# Altium schematic sheet DIB_Driver_Interface.SchDoc
size A
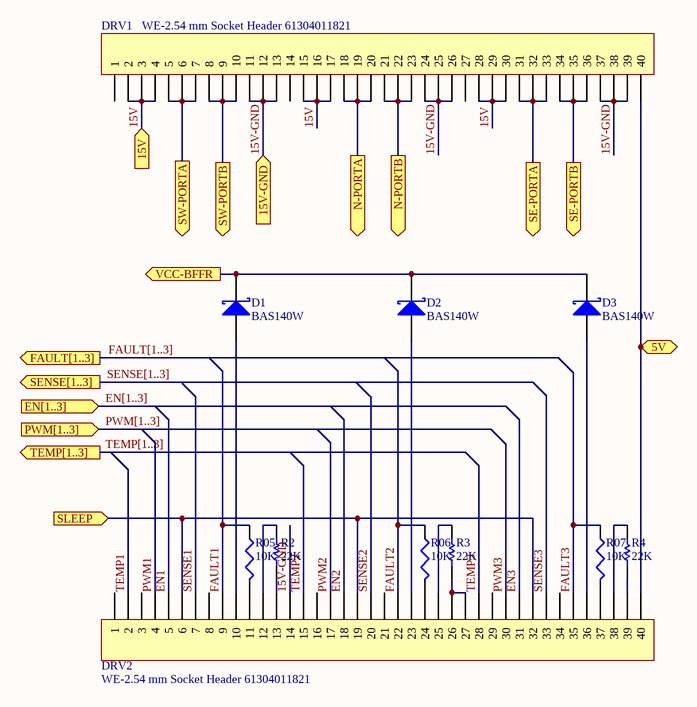
[diagram p0: DIB_Driver_Interface.SchDoc]

## Parts
D1  BAS140W  [SOD-323]
D2  BAS140W  [SOD-323]
D3  BAS140W  [SOD-323]
DRV1  WE-2.54 mm Socket Header 61304011821  [61304011821]
DRV2  WE-2.54 mm Socket Header 61304011821  [61304011821]
R2  22K  [AXIAL-0.3]
R3  22K  [AXIAL-0.3]
R4  22K  [AXIAL-0.3]
R05  10K  [J1-0603]
R06  10K  [J1-0603]
R07  10K  [J1-0603]

## Ports
5V (in), 15V (in), 15V-GND (in), EN[1..3] (in), FAULT[1..3] (out), N-PORTA (out), N-PORTB (out), PWM[1..3] (in), SE-PORTA (out), SE-PORTB (out), SENSE[1..3] (out), SLEEP (in), SW-PORTA (out), SW-PORTB (out), TEMP[1..3] (out), VCC-BFFR (out)

## Nets
5V: DRV1.40 DRV2.40 ; port 5V
15V: DRV1.2 DRV1.3 DRV1.4 DRV1.15 DRV1.16 DRV1.17 DRV1.28 DRV1.29 DRV1.30 ; port 15V
15V-GND: DRV1.11 DRV1.12 DRV1.13 DRV1.24 DRV1.25 DRV1.26 DRV1.37 DRV1.38 DRV1.39 DRV2.14 ; port 15V-GND
EN1: DRV2.5
EN2: DRV2.18
EN3: DRV2.31
FAULT1: DRV2.9 R05.1
FAULT2: DRV2.22 R06.1
FAULT3: DRV2.35 R07.1
N-PORTA: DRV1.18 DRV1.19 DRV1.20 ; port N-PORTA
N-PORTB: DRV1.21 DRV1.22 DRV1.23 ; port N-PORTB
PWM1: DRV2.4
PWM2: DRV2.17
PWM3: DRV2.30
SE-PORTA: DRV1.31 DRV1.32 DRV1.33 ; port SE-PORTA
SE-PORTB: DRV1.34 DRV1.35 DRV1.36 ; port SE-PORTB
SENSE1: DRV2.7
SENSE2: DRV2.20
SENSE3: DRV2.33
SLEEP: DRV2.6 DRV2.19 DRV2.32 ; port SLEEP
SW-PORTA: DRV1.5 DRV1.6 DRV1.7 ; port SW-PORTA
SW-PORTB: DRV1.8 DRV1.9 DRV1.10 ; port SW-PORTB
TEMP1: DRV2.2
TEMP2: DRV2.15
TEMP3: DRV2.28
VCC-BFFR: D1.1(K) D2.1(K) D3.1(K) ; port VCC-BFFR
NetD1_2: D1.2(A) DRV2.10
NetD2_2: D2.2(A) DRV2.23
NetD3_2: D3.2(A) DRV2.36
NetDRV2_11: DRV2.11 R05.2
NetDRV2_12: DRV2.12 R2.2
NetDRV2_13: DRV2.13 R2.1
NetDRV2_24: DRV2.24 R06.2
NetDRV2_25: DRV2.25 R3.2
NetDRV2_26: DRV2.26 DRV2.27 R3.1
NetDRV2_37: DRV2.37 R07.2
NetDRV2_38: DRV2.38 R4.2
NetDRV2_39: DRV2.39 R4.1

Not connected (* = marked no-connect by the designer): DRV1 1 14 27; DRV2 1 3 8 16 21 29 34

## Buses and harness runs
bus EN[1..3] = port EN[1..3]
bus FAULT[1..3] = port FAULT[1..3]
bus PWM[1..3] = port PWM[1..3]
bus SENSE[1..3] = port SENSE[1..3]
bus TEMP[1..3] = port TEMP[1..3]

## Library data of the parts
D1-D3 = BAS140W: Silicon AF Schottky Diode for High-Speed Switching; Published: 21-Mar-2003; LatestRevisionDate: 19-Mar-2004; LatestRevisionNote: Silkscreen size reduced.; DatasheetDocument: Oct-1999; PackageDocument: Sep-2000; PackageReference: SOD-323; Publisher: Altium Limited; ComponentLink1Description: Manufacturer Link; ComponentLink1URL: http://www.infineon.com/; ComponentLink2Description: Datasheet; ComponentLink2URL: http://www.infineon.com/upload/Document/cmc_upload/documents/009/386/bas70_bas170series_1.pdf
DRV1 DRV2 = WE-2.54 mm Socket Header 61304011821: WR-PHD 2.54 mm Socket Header; Manufacturer: W¨¹rth Elektronik eiSos GmbH; ComponentLink1 Description: Manufacturer; ComponentLink2 Description: Datasheet; NoPins: 40; Created Date: 29 March 2013; partNo: 61304011821; ComponentLink1URL: http://www.we-online.com; ComponentLink2URL: http://katalog.we-online.de/em/datasheet/6130xx11821.pdf; Created by: Karrer Zheng
R2-R4 = Res1: Resistor; Published: 8-Jun-2000; LatestRevisionDate: 17-Jul-2002; LatestRevisionNote: Re-released for DXP Platform.; PackageReference: AXIAL-0.3; Publisher: Altium Limited; PackageDescription: Axial Device, Thru-Hole; 2 Leads; 0.3 in Pin Spacing; Value: 22K
R05 R06 R07 = Res3: Resistor; Published: 8-Jun-2000; LatestRevisionDate: 29-May-2009; LatestRevisionNote: IPC-7351 Footprint Added.; PackageReference: J1-0603; Publisher: Altium Limited; PackageDescription: Chip Resistor; Value: 10K